# EasyEDA schematic SCH_ESP32-Furnace-Controller_2026-05-20.json

## Sheets
1 Sheet_1: TITLE: Sheet_1; REV: 1.0; Date: 2022-01-20; Sheet: 1/1; Drawn By: Pablo Llaguno; Company: Your Company
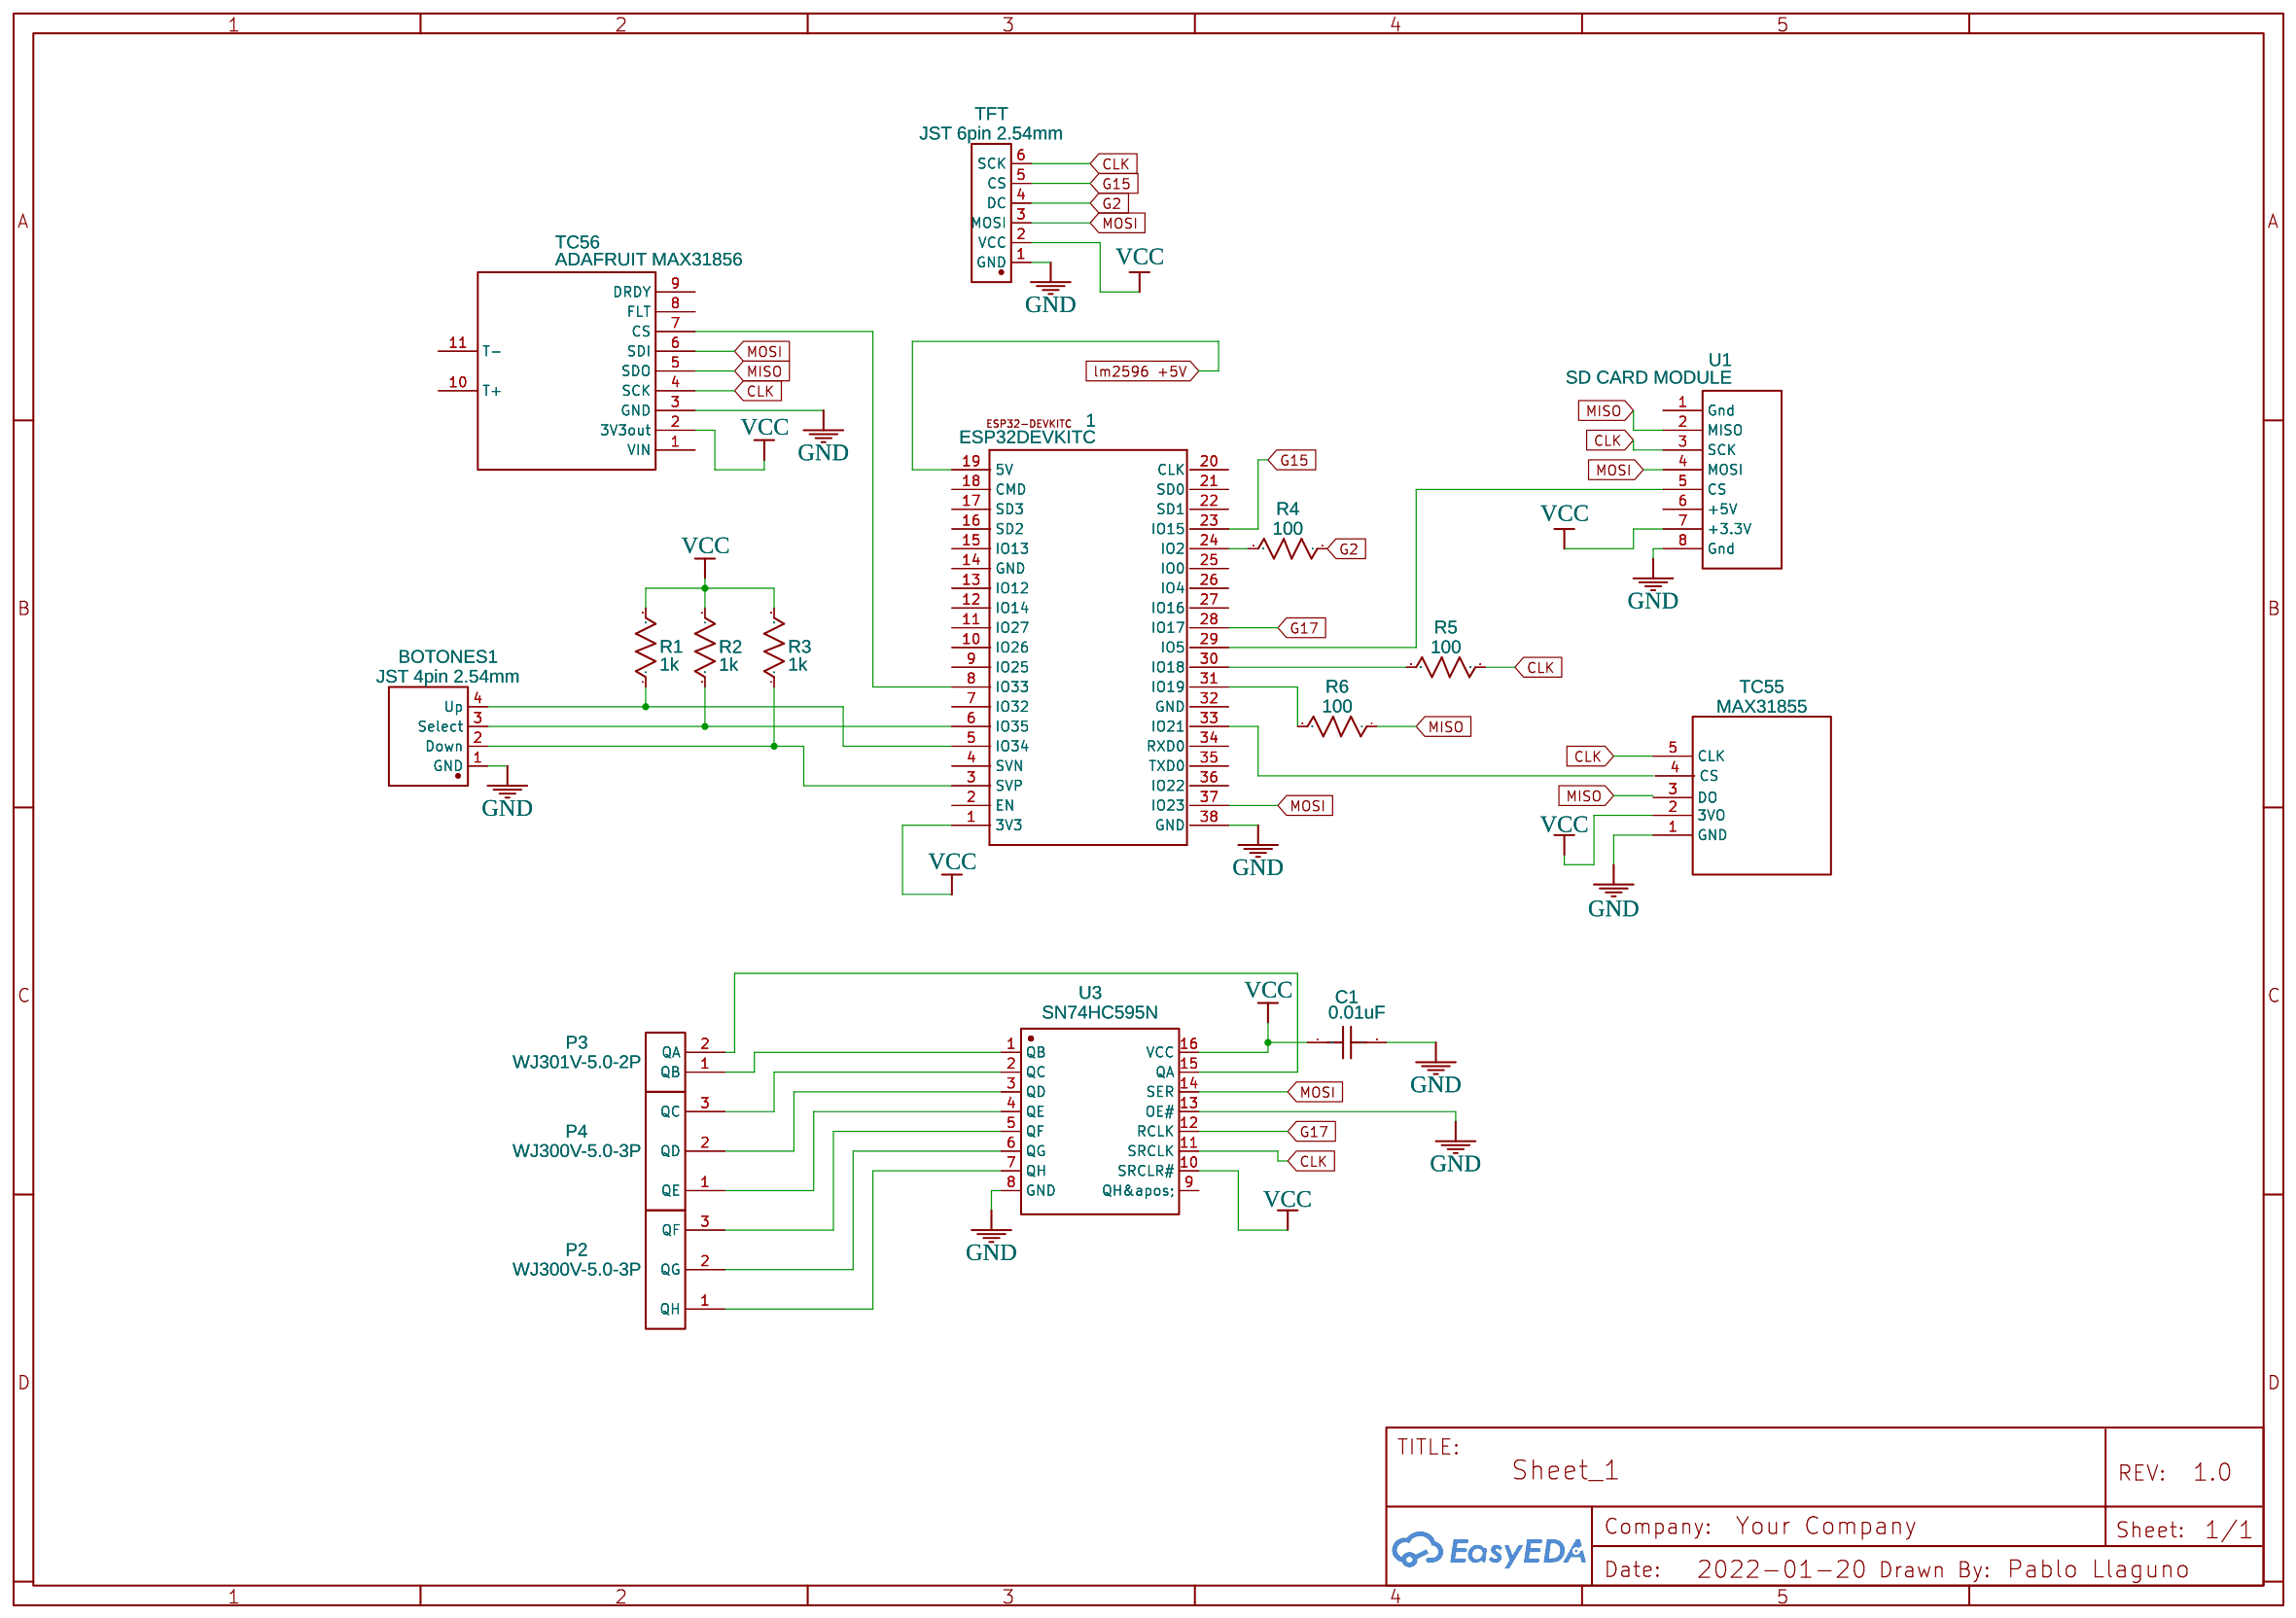
[diagram p0: Sheet_1]
2 Sheet_2: TITLE: Sheet_2; Date: 2022-08-16
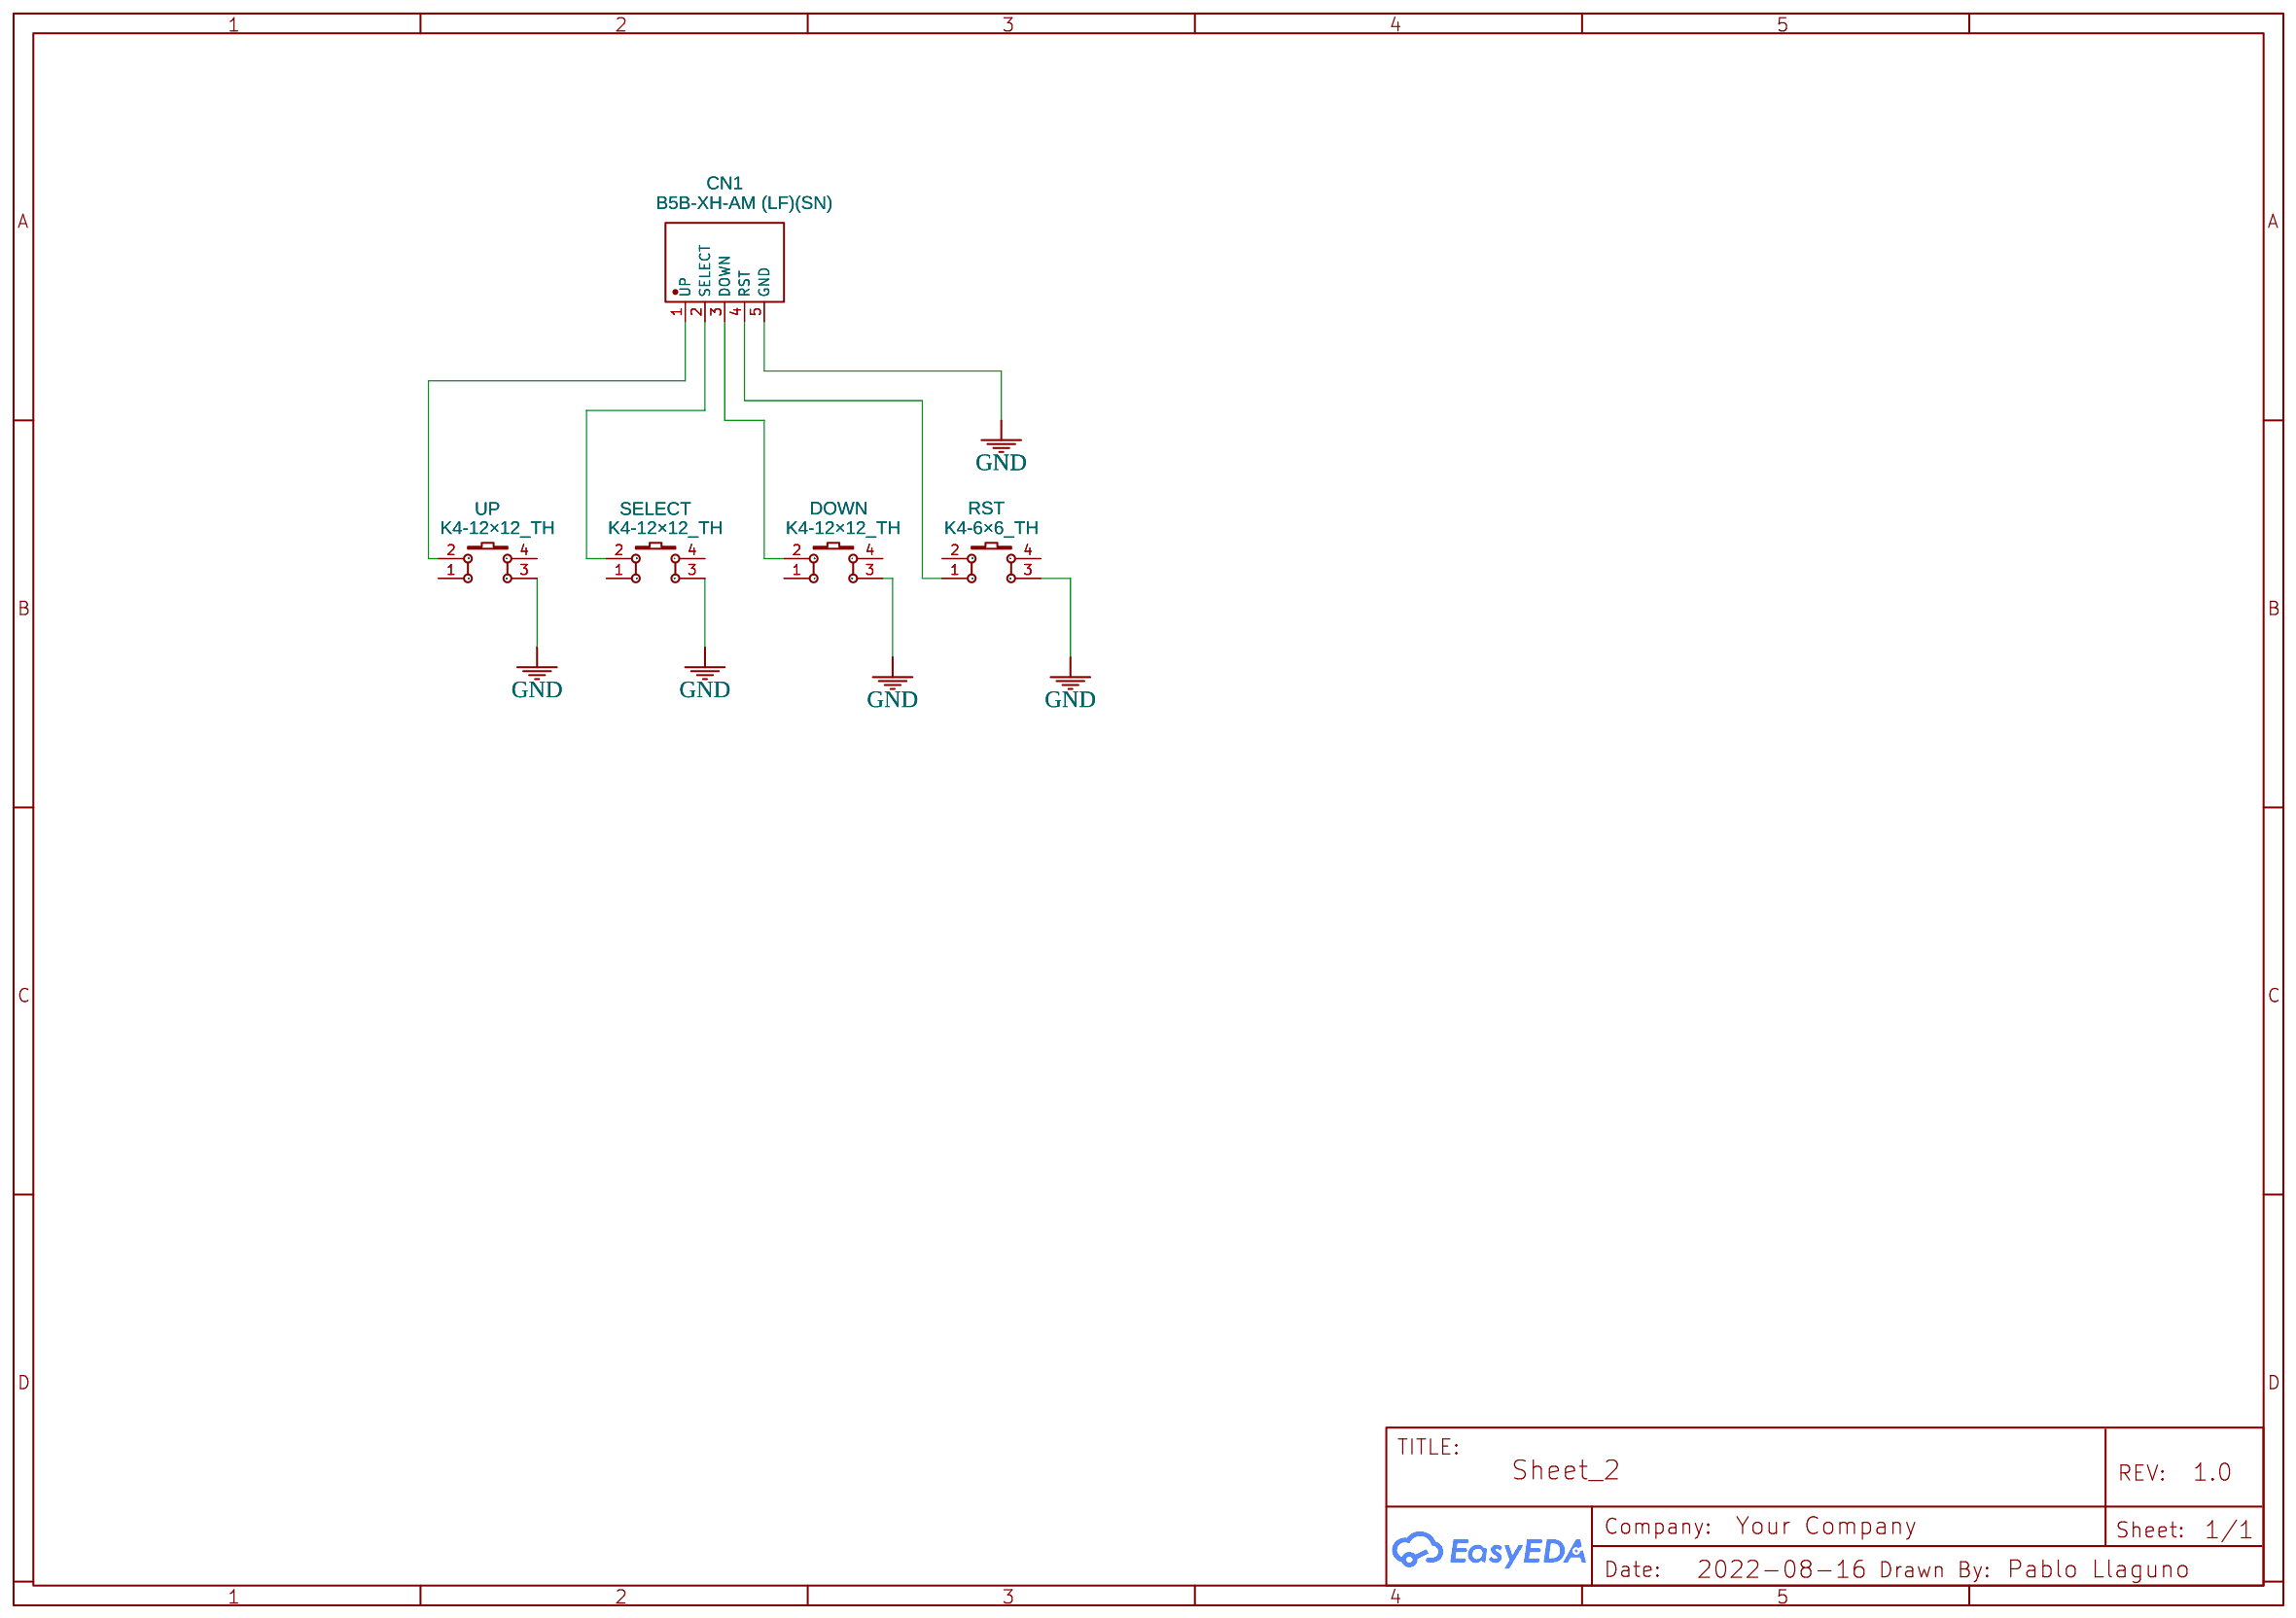
[diagram p1: Sheet_2]

## Parts
sheet Sheet_1
1  ESP32DEVKITC  [ESP32-DEVKITC]
BOTONES1  JST 4pin 2.54mm  [CONN-TH_XH2.54-4AW]
C1  0.01uF  [RAD-0.2]
P2  WJ300V-5.0-3P  [CONN-TH_3P-P5.00_WJ300V-5.00-3P]
P3  WJ301V-5.0-2P  [CONN-TH_2P-P5.00_WJ301V-5.00-2P]
P4  WJ300V-5.0-3P  [CONN-TH_3P-P5.00_WJ300V-5.00-3P]
R1  1k  [R_AXIAL-0.5]
R2  1k  [R_AXIAL-0.5]
R3  1k  [R_AXIAL-0.5]
R4  100  [R_AXIAL-0.5]
R5  100  [R_AXIAL-0.5]
R6  100  [R_AXIAL-0.5]
TC55  MAX31855  [MAX31855]
TC56  ADAFRUIT MAX31856  [ADAFRUIT MAX31856 MODULE FOOTPRINT]
TFT  JST 6pin 2.54mm  [CONN-TH_6P-P2.54_HCTL_XH-6AW_C2908615]
U1  SD CARD MODULE  [SD CARD MODULE W/ SD CARD]
U3  SN74HC595N  [DIP-16_L19.8-W6.5-P2.54-LS7.6-BL]
sheet Sheet_2
CN1  B5B-XH-AM (LF)(SN)  [CONN-TH_B5B-XH-AM-LF-SN]
DOWN  K4-12×12_TH  [KEY-TH_4P-L12.0-W12.0-P5.00-LS12.5]
RST  K4-6×6_TH  [KEY-TH_4P-L6.0-W6.0-P4.50-LS6.5]
SELECT  K4-12×12_TH  [KEY-TH_4P-L12.0-W12.0-P5.00-LS12.5]
UP  K4-12×12_TH  [KEY-TH_4P-L12.0-W12.0-P5.00-LS12.5]

## Library data of the parts
1 = ESP32DEVKITC: Contributor: Jan “Alpi” Mannsbart; Package Display: No
BOTONES1 = XH-4AW M: Supplier: LCSC; Supplier Part: C146115; Manufacturer: Boom Precision Elec; Contributor: LCSC; JLCPCB Part Class: Extended Part
C1 = C_RAD-0.2_US: Contributor: LCEDA_Lib
P2 P4 = WJ300V-5.0-3P: Supplier: LCSC; Manufacturer: ReliaPro; Supplier Part: C8467; JLCPCB Part Class: Extended Part
P3 = WJ301V-5.0-2P: Supplier: LCSC; Manufacturer: ReliaPro; Supplier Part: C8475; JLCPCB Part Class: Extended Part
R1-R6 = R_AXIAL-0.5_US: Contributor: LCEDA_Lib
TC55 = MAX31855: sourceId: 1T5FDZYC8; Supplier: AdaFruit
TC56 = ADAFRUIT MAX31856: Manufacturer Part: ADAFRUIT; link: https://learn.adafruit.com/adafruit-max31856-thermocouple-amplifier; Contributor: natan.reginaldo
TFT = XH-6AW_C2908615: Supplier: LCSC; Supplier Part: C2908615; Manufacturer: HCTL(华灿天禄); Manufacturer Part: XH-6AW; Contributor: LCSC
U1 = SD CARD MODULE: Manufacturer Part: sd card module; Contributor: andy2468
U3 = SN74HC595N: Supplier: LCSC; Manufacturer: TI; Supplier Part: C78711; JLCPCB Part Class: Extended Part
CN1 = B5B-XH-AM (LF)(SN): Supplier: LCSC; Supplier Part: C161872; Manufacturer: JST Sales America; Contributor: LCSC; JLCPCB Part Class: Extended Part
DOWN SELECT UP = K4-12×12_TH: Supplier Part: C128053; Supplier: LCSC; Manufacturer: 韩国韩荣; Manufacturer Part: K2-1103DP-M4SW-04; Contributor: LCEDA_Lib
RST = K4-6×6_TH: Supplier: LCSC; Supplier Part: C136684; Manufacturer: 韩国韩荣; Manufacturer Part: K2-1102DP-E4SW-04; Contributor: LCEDA_Lib

## Nets
GND: 1.38(GND) BOTONES1.1(GND) C1.2 CN1.5(GND) DOWN.3 RST.3 SELECT.3 TC55.1(GND) TC56.3(GND) TFT.1(GND) U1.8(Gnd) U3.8(GND) U3.13(OE#) UP.3
VCC: 1.1(3V3) C1.1 R1.2 R2.1 R3.2 TC55.2(3VO) TC56.2(3V3out) TFT.2(VCC) U1.7(+3.3V) U3.10(SRCLR#) U3.16(VCC)
CLK: R5.1 TC55.5(CLK) TC56.4(SCK) TFT.6(SCK) U1.3(SCK) U3.11(SRCLK)
G2: R4.1 TFT.4(DC)
G15: 1.23(IO15) TFT.5(CS)
G17: 1.28(IO17) U3.12(RCLK)
lm2596 +5V: 1.19(5V)
MISO: R6.1 TC56.5(SDO) U1.2(MISO)
MOSI: 1.37(IO23) TC56.6(SDI) TFT.3(MOSI) U1.4(MOSI) U3.14(SER)
Net-(1-3): 1.3(SVP) BOTONES1.2(Down) R3.1
Net-(1-5): 1.5(IO34) BOTONES1.4(Up) R1.1
Net-(1-6): 1.6(IO35) BOTONES1.3(Select) R2.2
Net-(1-8): 1.8(IO33) TC56.7(CS)
Net-(1-24): 1.24(IO2) R4.2
Net-(1-29): 1.29(IO5) U1.5(CS)
Net-(1-30): 1.30(IO18) R5.2
Net-(1-31): 1.31(IO19) R6.2
Net-(CN1-1): CN1.1(UP) UP.2
Net-(CN1-2): CN1.2(SELECT) SELECT.2
Net-(CN1-3): CN1.3(DOWN) DOWN.2
Net-(CN1-4): CN1.4(RST) RST.1
Net-(P2-1): P2.1(QH) U3.7(QH)
Net-(P2-2): P2.2(QG) U3.6(QG)
Net-(P2-3): P2.3(QF) U3.5(QF)
Net-(P3-1): P3.1(QB) U3.1(QB)
Net-(P3-2): P3.2(QA) U3.15(QA)
Net-(P4-1): P4.1(QE) U3.4(QE)
Net-(P4-2): P4.2(QD) U3.3(QD)
Net-(P4-3): P4.3(QC) U3.2(QC)

Not connected (* = marked no-connect by the designer): 1 2(EN) 4(SVN) 7(IO32) 9(IO25) 10(IO26) 11(IO27) 12(IO14) 13(IO12) 14(GND) 15(IO13) 16(SD2) 17(SD3) 18(CMD) 20(CLK) 21(SD0) 22(SD1) 25(IO0) 26(IO4) 27(IO16) 32(GND) 33(IO21) 34(RXD0) 35(TXD0) 36(IO22); DOWN 1 4; RST 2 4; SELECT 1 4; TC55 3(DO) 4(CS); TC56 1(VIN) 8(FLT) 9(DRDY) 10(T+) 11(T-); U1 1(Gnd) 6(+5V); U3 9(QH'); UP 1 4
